# Altium schematic sheet golgi_botV2.SchDoc
size 381 x 180 mm; SheetNumber: 1; SheetTotal: 1
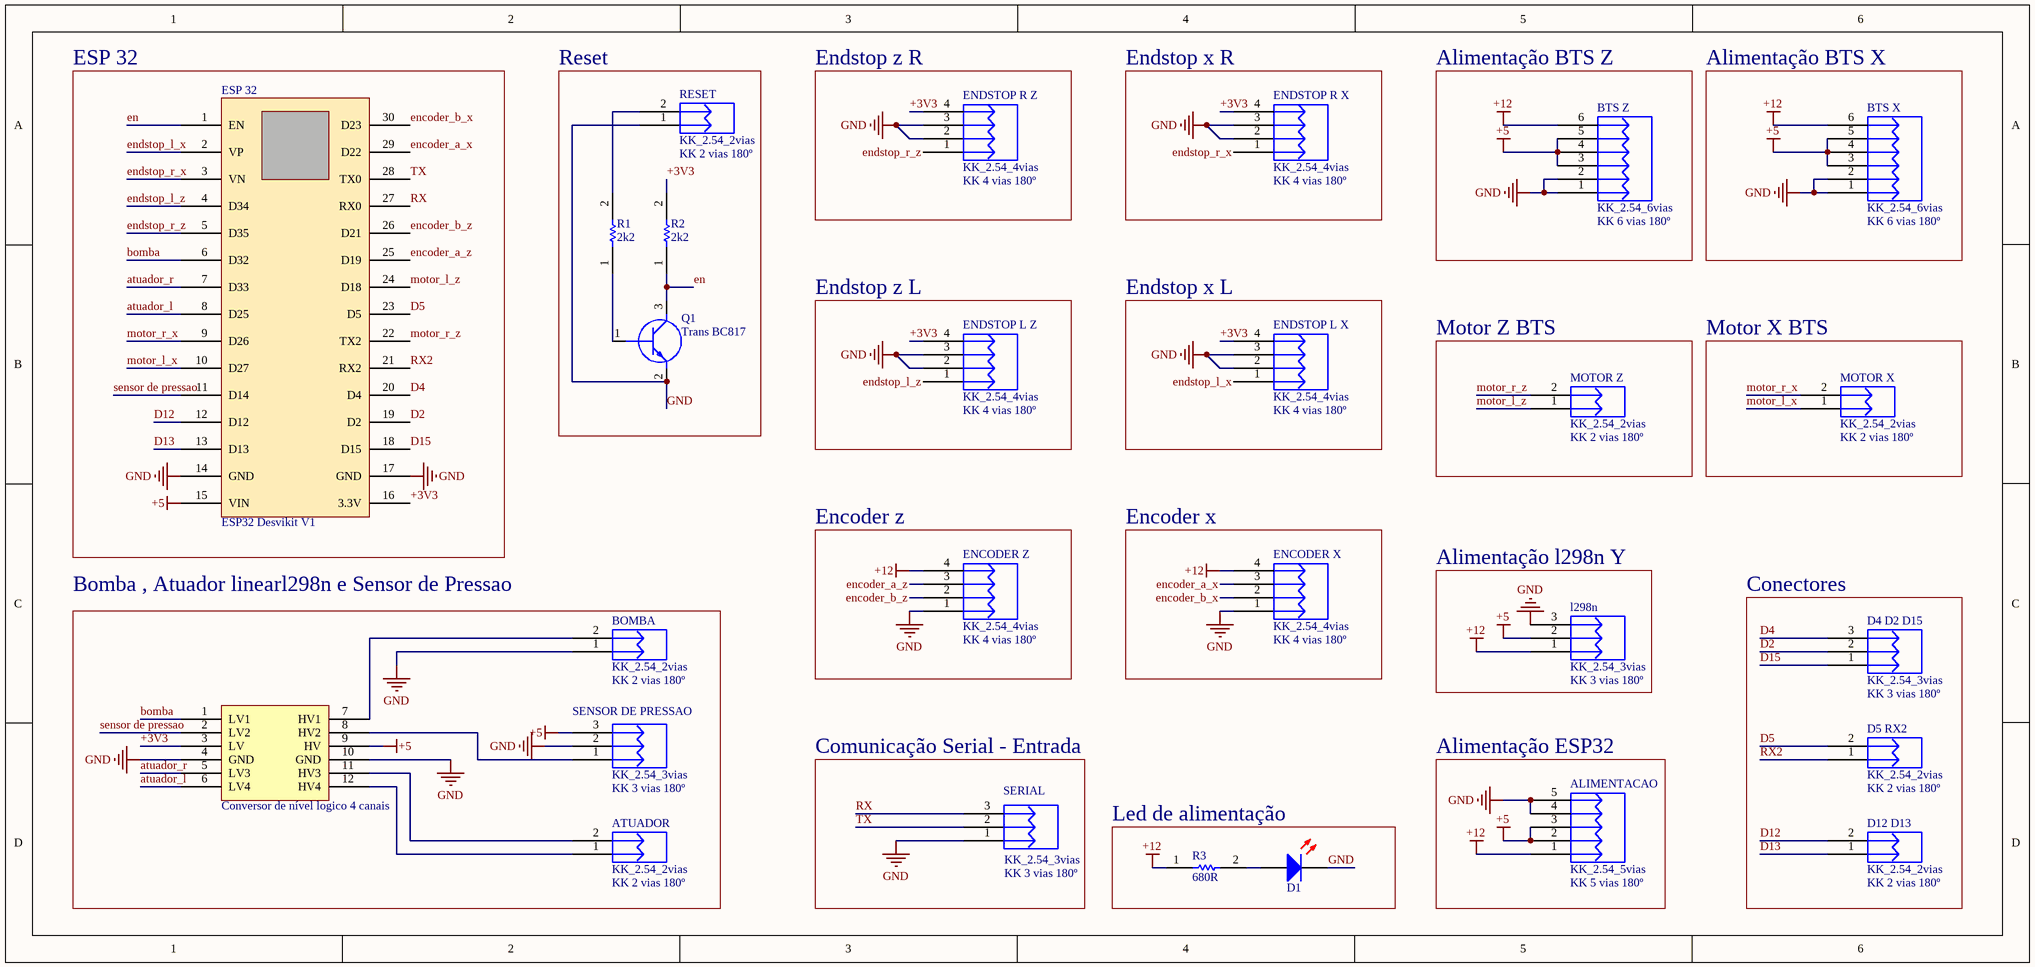
[diagram p0: golgi_botV2.SchDoc]

## Parts
?  Conversor de nível logico 4 canais  [Conversor de nível lógico 4 canais]
ALIMENTACAO  KK_2.54_5vias  Valor: KK 5 vias 180º  [KK_5vias_180°]
ATUADOR  KK_2.54_2vias  Valor: KK 2 vias 180º  [KK_2VIAS_180º]
BOMBA  KK_2.54_2vias  Valor: KK 2 vias 180º  [KK_2VIAS_180º]
BTS_X  KK_2.54_6vias  Valor: KK 6 vias 180º  [KK_6vias_180°]
BTS_Z  KK_2.54_6vias  Valor: KK 6 vias 180º  [KK_6vias_180°]
D1  LED 3MM RED  [LED RED]  (value not drawn)
D4_D2_D15  KK_2.54_3vias  Valor: KK 3 vias 180º  [KK_3vias_180º]
D5_RX2  KK_2.54_2vias  Valor: KK 2 vias 180º  [KK_2VIAS_180º]
D12_D13  KK_2.54_2vias  Valor: KK 2 vias 180º  [KK_2VIAS_180º]
ENCODER_X  KK_2.54_4vias  Valor: KK 4 vias 180º  [KK_4vias_180°]
ENCODER_Z  KK_2.54_4vias  Valor: KK 4 vias 180º  [KK_4vias_180°]
ENDSTOP_L_X  KK_2.54_4vias  Valor: KK 4 vias 180º  [KK_4vias_180°]
ENDSTOP_L_Z  KK_2.54_4vias  Valor: KK 4 vias 180º  [KK_4vias_180°]
ENDSTOP_R_X  KK_2.54_4vias  Valor: KK 4 vias 180º  [KK_4vias_180°]
ENDSTOP_R_Z  KK_2.54_4vias  Valor: KK 4 vias 180º  [KK_4vias_180°]
ESP_32  value ESP32 Desvikit V1  [ESP32_Desvikit_v1]  (hidden comment: microcontrolador)
l298n  KK_2.54_3vias  Valor: KK 3 vias 180º  [KK_3vias_180º]
MOTOR_X  KK_2.54_2vias  Valor: KK 2 vias 180º  [KK_2VIAS_180º]
MOTOR_Z  KK_2.54_2vias  Valor: KK 2 vias 180º  [KK_2VIAS_180º]
Q1  Trans BC817  [SOT96P240X110-3N]
R1  2k2  [RESC3216X60N]
R2  2k2  [RESC3216X60N]
R3  680R  [RESC3216X60N]
RESET  KK_2.54_2vias  Valor: KK 2 vias 180º  [KK_2VIAS_180º]
SENSOR_DE_PRESSAO  KK_2.54_3vias  Valor: KK 3 vias 180º  [KK_3vias_180º]
SERIAL  KK_2.54_3vias  Valor: KK 3 vias 180º  [KK_3vias_180º]

## Blocks framed on the sheet
ESP 32: ESP_32
Reset: Q1 R1 R2 RESET
Endstop z R: ENDSTOP_R_Z
Endstop x R: ENDSTOP_R_X
Alimentação BTS Z: BTS_Z
Alimentação BTS X: BTS_X
Endstop z L: ENDSTOP_L_Z
Endstop x L: ENDSTOP_L_X
Motor Z BTS: MOTOR_Z
Motor X BTS: MOTOR_X
Encoder z: ENCODER_Z
Encoder x: ENCODER_X
Alimentação l298n Y: l298n
Conectores: D4_D2_D15 D5_RX2 D12_D13
Bomba , Atuador linearl298n e Sensor de Pressao: ? ATUADOR BOMBA SENSOR_DE_PRESSAO
Comunicação Serial - Entrada: SERIAL
Alimentação ESP32: ALIMENTACAO
Led de alimentação: D1 R3

## Nets
+5: ?.9(HV) ALIMENTACAO.2 ALIMENTACAO.3 BTS_X.3 BTS_X.4 BTS_X.5 BTS_Z.3 BTS_Z.4 BTS_Z.5 ESP_32.15(VIN) l298n.2 SENSOR_DE_PRESSAO.3
+12: ALIMENTACAO.1 BTS_X.6 BTS_Z.6 ENCODER_X.4 ENCODER_Z.4 l298n.1 R3.1
GND: ?.4(GND) ?.10(GND) ALIMENTACAO.4 ALIMENTACAO.5 BOMBA.1 BTS_X.1 BTS_X.2 BTS_Z.1 BTS_Z.2 D1.2(K) ENCODER_X.1 ENCODER_Z.1 ENDSTOP_L_X.2 ENDSTOP_L_X.3 ENDSTOP_L_Z.2 ENDSTOP_L_Z.3 ENDSTOP_R_X.2 ENDSTOP_R_X.3 ENDSTOP_R_Z.2 ENDSTOP_R_Z.3 ESP_32.14(GND) ESP_32.17(GND) l298n.3 Q1.2(E) RESET.1 SENSOR_DE_PRESSAO.2 SERIAL.1
+3V3: ?.3(LV) ENDSTOP_L_X.4 ENDSTOP_L_Z.4 ENDSTOP_R_X.4 ENDSTOP_R_Z.4 ESP_32.16(3.3V) R2.2
atuador_l: ?.6(LV4) ESP_32.8(D25)
atuador_r: ?.5(LV3) ESP_32.7(D33)
bomba: ?.1(LV1) ESP_32.6(D32)
D2: D4_D2_D15.2 ESP_32.19(D2)
D4: D4_D2_D15.3 ESP_32.20(D4)
D5: D5_RX2.2 ESP_32.23(D5)
D12: D12_D13.2 ESP_32.12(D12)
D13: D12_D13.1 ESP_32.13(D13)
D15: D4_D2_D15.1 ESP_32.18(D15)
en: ESP_32.1(EN) Q1.3(C) R2.1
encoder_a_x: ENCODER_X.3 ESP_32.29(D22)
encoder_a_z: ENCODER_Z.3 ESP_32.25(D19)
encoder_b_x: ENCODER_X.2 ESP_32.30(D23)
encoder_b_z: ENCODER_Z.2 ESP_32.26(D21)
endstop_l_x: ENDSTOP_L_X.1 ESP_32.2(VP)
endstop_l_z: ENDSTOP_L_Z.1 ESP_32.4(D34)
endstop_r_x: ENDSTOP_R_X.1 ESP_32.3(VN)
endstop_r_z: ENDSTOP_R_Z.1 ESP_32.5(D35)
motor_l_x: ESP_32.10(D27) MOTOR_X.1
motor_l_z: ESP_32.24(D18) MOTOR_Z.1
motor_r_x: ESP_32.9(D26) MOTOR_X.2
motor_r_z: ESP_32.22(TX2) MOTOR_Z.2
RX: ESP_32.27(RX0) SERIAL.3
RX2: D5_RX2.1 ESP_32.21(RX2)
sensor de pressao: ?.2(LV2) ESP_32.11(D14)
TX: ESP_32.28(TX0) SERIAL.2
Net?_7: ?.7(HV1) BOMBA.2
Net?_8: ?.8(HV2) SENSOR_DE_PRESSAO.1
Net?_11: ?.11(HV3) ATUADOR.2
Net?_12: ?.12(HV4) ATUADOR.1
NetD1_1: D1.1(A) R3.2
NetQ1_1: Q1.1(B) R1.1
NetR1_2: R1.2 RESET.2

## Library data of the parts
ALIMENTACAO = KK_2.54_5vias: Conector KK 2.54mm 5 vias; Descrição: Conector KK 3 vias com passo 2.54mm; Encapsulamento: PTH - 180º; Modelo: 3 vias - 180º; Marca: *; Observação: *
ATUADOR BOMBA D5_RX2 D12_D13 MOTOR_X MOTOR_Z RESET = KK_2.54_2vias: Conector KK 2.54mm 2 vias; Descrição: Conector KK 3 vias com passo 2.54mm; Encapsulamento: PTH - 180º; Modelo: 2 vias - 180º; Marca: *; Observação: *
BTS_X BTS_Z = KK_2.54_6vias: Conector KK 2.54mm 6 vias; Descrição: Conector KK 3 vias com passo 2.54mm; Encapsulamento: PTH - 180º; Modelo: 3 vias - 180º; Marca: *; Observação: *
D1 = LED 3MM RED: Manufacturer: Paralight; Manufacturer Part Number: IMP585; Wavelength Typ: 625; Forward Voltage: 2; Forward Current If: 20; Luminous Intensity: 3; LED Mounting: Through Hole; Lens Shape: Round; Viewing Angle: 60°; SVHC: No SVHC (15-Jun-2015); External Diameter: 2.9; External Length / Height: 4.6; Forward Voltage VF Max: 2.5; LED / Lamp Size: 3mm / T-1; LED Type: Standard; Lead Cross-section Depth: 0.5; Luminous Intensity @ If Min: 0.7; PIV Max: 5; Peak Forward Current: 7; Voltage Vf Typ: 2.2V<!--FANDB--><div class="features-and-benefits-container"><div class="features-and-benefits-description"><span class="features-benefits-value">The L-934LID from Kingbright is a through hole round shape high efficiency red colour LED. The device is made of gallium arsenide phosphide on gallium phosphide orange light emitting diode. This LED is widely used because of low power consumption, long life and solid state reliability.</span></div><div class="features-and-benefits-list"><ul class="features-and-benefits-list-list"><li class="features-and-benefits-list-item">Standard bulb size of T-1 (3mm)</li><li class="features-and-benefits-list-item">Reliable and rugged</li><li class="features-and-benefits-list-item">Viewing angle is 60°</li><li class="features-and-benefits-list-item">Luminous intensity of 3mcd at 2mA</li><li class="features-and-benefits-list-item">Forward voltage is 2.0V</li><li class="features-and-benefits-list-item">Forward current (If) is 20mA</li><li class="features-and-benefits-list-item">Dominant wavelength is 625nm at IF=20mA</li><li class="features-and-benefits-list-item">Peak wavelength is 627nm at IF=20; Supplier 1: Mult Comercial; RoHS: YES; Stock 1: 35260; Pricing 1: 1=0.15 (BRL); LED Colour: Red; Bulb Size: 3mm; Packaging: Each; MSL: -; Current If Luminous Intensity: 2; Dominant Wavelength: 625; Forward Current If Max: 20; Lead Cross-section Width: 0.5; Lead Spacing: 2.54; Luminous Intensity Typ: 3; Mounting Type: PCB Through Hole; No. of Pins: 2; Operating Temperature Max: 85; Operating Temperature Min: -40; Operating Temperature Range: -40°C to +85; Peak Wavelength: 625; ComponentLink1URL: http://loja.multcomercial.com.br/led-3mm-vermelho-difuso-l-314hd-paralight.html; ComponentLink1Description: http://loja.multcomercial.com.br/led-3mm-vermelho-difuso-l-314hd-paralight.html; Supplier Part Number 1: Led 3mm Vermelho Difuso L-314HD - Paralight
D4_D2_D15 l298n SENSOR_DE_PRESSAO SERIAL = KK_2.54_3vias: Conector KK 2.54mm 3 vias; Descrição: Conector KK 3 vias com passo 2.54mm; Encapsulamento: PTH - 180º; Modelo: 3 vias - 180º; Marca: *; Observação: *
ENCODER_X ENCODER_Z ENDSTOP_L_X ENDSTOP_L_Z ENDSTOP_R_X ENDSTOP_R_Z = KK_2.54_4vias: Conector KK 2.54mm 4 vias; Descrição: Conector KK 3 vias com passo 2.54mm; Encapsulamento: PTH - 180º; Modelo: 3 vias - 180º; Marca: *; Observação: *
ESP_32 = ESP32 Desvikit v1: microcontrolador com moculo bluethoth e wifi
Q1 = Trans BC817: Transistor BJT NPN BC817-25-7-F; Manufacturer_Name: Diodes Inc.; Datasheet Link: https://www.diodes.com/assets/Datasheets/ds11107.pdf; Height: 1.1mm; Manufacturer_Part_Number: BC817-25-7-F; Mouser Part Number: 621-BC817-25-7-F; Mouser Price/Stock: https://www.mouser.co.uk/ProductDetail/Diodes-Incorporated/BC817-25-7-F?qs=rGAXPo9uwV0jK0EyLZnqOw%3D%3D; Arrow Part Number: BC817-25-7-F; Arrow Price/Stock: https://www.arrow.com/en/products/bc817-25-7-f/diodes-incorporated
R1-R3 = Resistor 1206: Resistor; Manufacturer_Name: Vishay; Manufacturer_Part_Number: CRCW12064K70FKEA; Datasheet Link: http://docs-emea.rs-online.com/webdocs/13ec/0900766b813ecc08.pdf; Height: 0.6mm; Mouser Part Number: 71-CRCW1206-4.7K-E3; Mouser Price/Stock: https://www.mouser.co.uk/ProductDetail/Vishay-Dale/CRCW12064K70FKEA?qs=1vm4qhDHCvlKJmatsKzyFQ%3D%3D; Arrow Part Number: CRCW12064K70FKEA; Arrow Price/Stock: https://www.arrow.com/en/products/crcw12064k70fkea/vishay